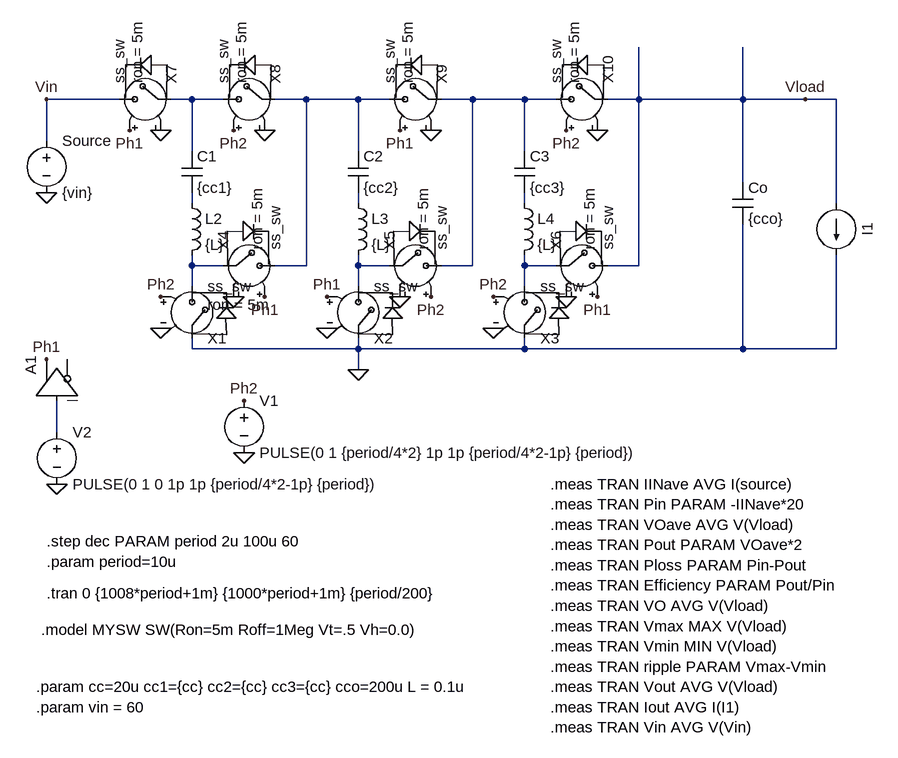
[diagram p0: schematic 5to1_fibonacci_distributed.asc]
5to1_fibonacci_distributed.asc, the LTspice schematic file:
Version 4
SHEET 1 1688 916
WIRE -592 -224 -704 -224
WIRE -480 -224 -512 -224
WIRE -432 -224 -480 -224
WIRE -304 -224 -352 -224
WIRE -224 -224 -304 -224
WIRE -176 -224 -224 -224
WIRE -48 -224 -96 -224
WIRE 32 -224 -48 -224
WIRE 80 -224 32 -224
WIRE 208 -224 208 -304
WIRE 208 -224 160 -224
WIRE 368 -224 368 -304
WIRE 368 -224 208 -224
WIRE 464 -224 368 -224
WIRE 512 -224 464 -224
WIRE -704 -160 -704 -224
WIRE -480 -144 -480 -224
WIRE -224 -144 -224 -224
WIRE 32 -144 32 -224
WIRE 368 -96 368 -224
WIRE -480 -64 -480 -80
WIRE -224 -64 -224 -80
WIRE 32 -64 32 -80
WIRE 512 -64 512 -224
WIRE -480 32 -480 16
WIRE -432 32 -480 32
WIRE -304 32 -304 -224
WIRE -304 32 -352 32
WIRE -224 32 -224 16
WIRE -176 32 -224 32
WIRE -48 32 -48 -224
WIRE -48 32 -96 32
WIRE 32 32 32 16
WIRE 80 32 32 32
WIRE 208 32 208 -224
WIRE 208 32 160 32
WIRE -480 64 -480 32
WIRE -224 64 -224 32
WIRE 32 64 32 32
WIRE -480 160 -480 144
WIRE -224 160 -224 144
WIRE -224 160 -480 160
WIRE 32 160 32 144
WIRE 32 160 -224 160
WIRE 368 160 368 -32
WIRE 368 160 32 160
WIRE 512 160 512 16
WIRE 512 160 368 160
WIRE -224 192 -224 160
WIRE -688 288 -688 240
FLAG -688 368 0
FLAG -704 176 Ph1
FLAG -704 -80 0
FLAG -576 -176 Ph1
FLAG -416 -176 Ph2
FLAG -528 -176 0
FLAG -368 -176 0
FLAG -704 -224 Vin
FLAG 464 -224 Vload
FLAG -400 240 Ph2
FLAG -160 -176 Ph1
FLAG -112 -176 0
FLAG 96 -176 Ph2
FLAG 144 -176 0
FLAG -224 192 0
FLAG -368 80 Ph1
FLAG -272 80 Ph1
FLAG 144 80 Ph1
FLAG -528 80 Ph2
FLAG -112 80 Ph2
FLAG -16 80 Ph2
FLAG -528 128 0
FLAG -416 80 0
FLAG -160 80 0
FLAG -16 128 0
FLAG 96 80 0
FLAG -272 128 0
FLAG -400 320 0
SYMBOL voltage -688 272 R0
WINDOW 123 0 0 Left 2
WINDOW 39 0 0 Left 2
SYMATTR InstName V2
SYMATTR Value PULSE(0 1 0 1p 1p {period/4*2-1p} {period})
SYMBOL Digital\\buf -752 240 R270
SYMATTR InstName A1
SYMBOL voltage -704 -176 R0
WINDOW 123 0 0 Left 2
WINDOW 39 0 0 Left 2
SYMATTR InstName Source
SYMATTR Value {vin}
SYMBOL cap -496 -144 R0
SYMATTR InstName C1
SYMATTR Value {cc1}
SYMATTR SpiceLine ic = {vin/5*3}
SYMATTR SpiceLine2 Rser = 1m
SYMBOL cap 352 -96 R0
SYMATTR InstName Co
SYMATTR Value {cco}
SYMATTR SpiceLine ic = {vin/5}
SYMATTR SpiceLine2 Rser = 2m
SYMBOL current 512 -64 R0
WINDOW 0 32 40 VTop 2
WINDOW 3 96 52 Invisible 2
WINDOW 123 0 0 Left 2
WINDOW 39 0 0 Left 2
SYMATTR InstName I1
SYMATTR Value PULSE(0 2 0 {100*period} 0 10 20 1)
SYMBOL cap -240 -144 R0
SYMATTR InstName C2
SYMATTR Value {cc2}
SYMATTR SpiceLine ic = {vin/5*2}
SYMATTR SpiceLine2 Rser = 1m
SYMBOL cap 16 -144 R0
SYMATTR InstName C3
SYMATTR Value {cc3}
SYMATTR SpiceLine ic = {vin/5}
SYMATTR SpiceLine2 Rser = 1m
SYMBOL ind -496 -80 R0
SYMATTR InstName L2
SYMATTR Value {L}
SYMATTR SpiceLine Rser=1m
SYMBOL ind -240 -80 R0
SYMATTR InstName L3
SYMATTR Value {L}
SYMATTR SpiceLine Rser=1m
SYMBOL ind 16 -80 R0
SYMATTR InstName L4
SYMATTR Value {L}
SYMATTR SpiceLine Rser=1m
SYMBOL ss_sw -480 160 M180
WINDOW 39 24 68 Left 2
SYMATTR InstName X1
SYMATTR SpiceLine ron = 5m
SYMBOL ss_sw -224 160 M180
SYMATTR InstName X2
SYMATTR SpiceLine ron = 5m
SYMBOL ss_sw 32 160 M180
SYMATTR InstName X3
SYMATTR SpiceLine ron = 5m
SYMBOL ss_sw -448 32 R270
WINDOW 39 24 68 Left 2
SYMATTR InstName X4
SYMATTR SpiceLine ron = 5m
SYMBOL ss_sw -192 32 R270
WINDOW 39 24 68 Left 2
SYMATTR InstName X5
SYMATTR SpiceLine ron = 5m
SYMBOL ss_sw 64 32 R270
WINDOW 39 24 68 Left 2
SYMATTR InstName X6
SYMATTR SpiceLine ron = 5m
SYMBOL ss_sw -496 -224 M270
WINDOW 39 24 68 Left 2
SYMATTR InstName X7
SYMATTR SpiceLine ron = 5m
SYMBOL ss_sw -336 -224 M270
WINDOW 39 24 68 Left 2
SYMATTR InstName X8
SYMATTR SpiceLine ron = 5m
SYMBOL ss_sw -80 -224 M270
WINDOW 39 24 68 Left 2
SYMATTR InstName X9
SYMATTR SpiceLine ron = 5m
SYMBOL ss_sw 176 -224 M270
WINDOW 39 24 68 Left 2
SYMATTR InstName X10
SYMATTR SpiceLine ron = 5m
SYMBOL voltage -400 224 R0
WINDOW 123 0 0 Left 2
WINDOW 39 0 0 Left 2
SYMATTR InstName V1
SYMATTR Value PULSE(0 1 {period/4*2} 1p 1p {period/4*2-1p} {period})
TEXT -712 592 Left 2 !.model MYSW SW(Ron=5m Roff=1Meg Vt=.5 Vh=0.0)
TEXT 72 368 Left 2 !.meas TRAN IINave AVG I(source)\n.meas TRAN Pin PARAM -IINave*20\n.meas TRAN VOave AVG V(Vload)\n.meas TRAN Pout PARAM VOave*2\n.meas TRAN Ploss PARAM Pin-Pout\n.meas TRAN Efficiency PARAM Pout/Pin\n.meas TRAN VO AVG V(Vload)\n.meas TRAN Vmax MAX V(Vload)\n.meas TRAN Vmin MIN V(Vload)\n.meas TRAN ripple PARAM Vmax-Vmin\n.meas TRAN Vout AVG V(Vload)\n.meas TRAN Iout AVG I(I1)\n.meas TRAN Vin AVG V(Vin)
TEXT -720 680 Left 2 !.param cc=20u cc1={cc} cc2={cc} cc3={cc} cco=200u L = 0.1u\n.param vin = 60
TEXT -704 536 Left 2 !.tran 0 {1008*period+1m} {1000*period+1m} {period/200}
TEXT -704 456 Left 2 !.step dec PARAM period 2u 100u 60\n.param period=10u

The netlist it stands for:
* 5to1_fibonacci_distributed.asc
V2 N010 0 PULSE(0 1 0 1p 1p {period/4*2-1p} {period})
A1 N010 0 0 0 0 0 Ph1 0 BUF
V§Source Vin 0 {vin}
C1 N001 N004 {cc1} ic = {vin/5*3} Rser = 1m
Co Vload 0 {cco} ic = {vin/5} Rser = 2m
I1 Vload 0 PULSE(0 2 0 {100*period} 0 10 20 1)
C2 N002 N005 {cc2} ic = {vin/5*2} Rser = 1m
C3 N003 N006 {cc3} ic = {vin/5} Rser = 1m
L2 N004 N007 {L} Rser=1m
L3 N005 N008 {L} Rser=1m
L4 N006 N009 {L} Rser=1m
XX1 0 N007 Ph2 0 ss_sw ron = 5m  ; pins A B NC+ NC-
XX2 0 N008 Ph1 0 ss_sw ron = 5m  ; pins A B NC+ NC-
XX3 0 N009 Ph2 0 ss_sw ron = 5m  ; pins A B NC+ NC-
XX4 N007 N002 Ph1 0 ss_sw ron = 5m  ; pins A B NC+ NC-
XX5 N008 N003 Ph2 0 ss_sw ron = 5m  ; pins A B NC+ NC-
XX6 N009 Vload Ph1 0 ss_sw ron = 5m  ; pins A B NC+ NC-
XX7 N001 Vin Ph1 0 ss_sw ron = 5m  ; pins A B NC+ NC-
XX8 N002 N001 Ph2 0 ss_sw ron = 5m  ; pins A B NC+ NC-
XX9 N003 N002 Ph1 0 ss_sw ron = 5m  ; pins A B NC+ NC-
XX10 Vload N003 Ph2 0 ss_sw ron = 5m  ; pins A B NC+ NC-
V1 Ph2 0 PULSE(0 1 {period/4*2} 1p 1p {period/4*2-1p} {period})
.model MYSW SW(Ron=5m Roff=1Meg Vt=.5 Vh=0.0)
.meas TRAN IINave AVG I(source)
.meas TRAN Pin PARAM -IINave*20
.meas TRAN VOave AVG V(Vload)
.meas TRAN Pout PARAM VOave*2
.meas TRAN Ploss PARAM Pin-Pout
.meas TRAN Efficiency PARAM Pout/Pin
.meas TRAN VO AVG V(Vload)
.meas TRAN Vmax MAX V(Vload)
.meas TRAN Vmin MIN V(Vload)
.meas TRAN ripple PARAM Vmax-Vmin
.meas TRAN Vout AVG V(Vload)
.meas TRAN Iout AVG I(I1)
.meas TRAN Vin AVG V(Vin)
.param cc=20u cc1={cc} cc2={cc} cc3={cc} cco=200u L = 0.1u
.param vin = 60
.tran 0 {1008*period+1m} {1000*period+1m} {period/200}
.step dec PARAM period 2u 100u 60
.param period=10u
.backanno
.end